# Altium schematic sheet ADC_1CH.SchDoc: Stabilizer
size 420 x 297 mm; EDA_Number: ARTIQ; Projet: Sampler; Author: G.Kasprowicz; CompanyName: WUT ISE; DrawnBy: G.Kasprowicz; Organization: WUT ISE; Address1: PW ISE; Address2: Nowowiejska 15/19 00-665 Warsaw; Address3: gkasprow@gmail.com; DocumentNumber: 8; Revision: 3.4; SheetNumber: 8; SheetTotal: 11; ModifiedBy: -; CheckedDate: -; Title2: ADC; DivGrp: WUT ISE; Designer: G.Kasprowicz; ModifiedDate: -; ProjectName: Sensor Box
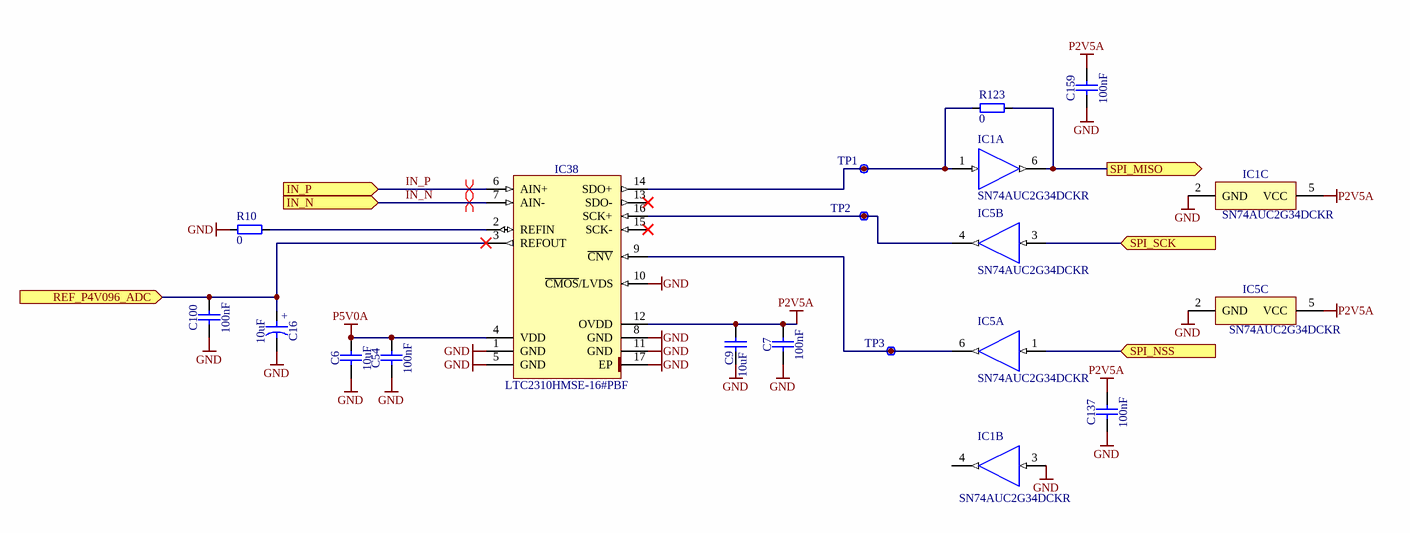
[diagram p0: ADC_1CH.SchDoc]

## Parts
C6  10uF  [CAPC2012X95N]
C7  100nF  [CAPC1005X55N]
C9  10uF  [CAPC2012X95N]
C16  10uF  [CAPMP3216X180N]
C54  100nF  [CAPC1005X55N]
C100  100nF  [CAPC1005X55N]
C137  100nF  [CAPC1005X55N]
C159  100nF  [CAPC1005X55N]
IC1  SN74AUC2G34DCKR  [DCK0006A_M]  (parts A,B,C of 3)
IC5  SN74AUC2G34DCKR  [DCK0006A_M]  (parts A,B,C of 3)
IC38  LTC2310HMSE-16#PBF  [SOP50P490X110-17N-R175X290]
R10  0  [RESC1005X40N]
R123  0  [RESC1005X40N]
TP1  Test Point  [TPS127]  (value not drawn)
TP2  Test Point  [TPS127]  (value not drawn)
TP3  Test Point  [TPS127]  (value not drawn)

## Ports
IN_N (in), IN_P (in), REF_P4V096_ADC (in), SPI_MISO (out), SPI_NSS (in), SPI_SCK (in)

## Nets
GND: C6.1 C7.1 C9.1 C16.2 C54.1 C100.1 C137.1 C159.1 IC1.2(GND) IC1.3(2A) IC5.2(GND) IC38.1(GND) IC38.5(GND) IC38.8(GND) IC38.10(~{CMOS}/LVDS) IC38.11(GND) IC38.17(EP) R10.1
P2V5A: C7.2 C9.2 C137.2 C159.2 IC1.5(VCC) IC5.5(VCC) IC38.12(OVDD)
P5V0A: C6.2 C54.2 IC38.4(VDD)
IN_N: IC38.7(AIN-) ; port IN_N
IN_P: IC38.6(AIN+) ; port IN_P
REF_P4V096_ADC: C16.1 C100.2 IC38.3(REFOUT) ; port REF_P4V096_ADC
SPI_MISO: IC1.6(1Y) R123.2 ; port SPI_MISO
SPI_NSS: IC5.1(1A) ; port SPI_NSS
SPI_SCK: IC5.3(2A) ; port SPI_SCK
NetIC1_1: IC1.1(1A) IC38.14(SDO+) R123.1 TP1.1
NetIC5_4: IC5.4(2Y) IC38.16(SCK+) TP2.1
NetIC5_6: IC5.6(1Y) IC38.9(~{CNV}) TP3.1
NetIC38_2: IC38.2(REFIN) R10.2

Not connected (* = marked no-connect by the designer): IC1 4(2Y); IC38 13(SDO-)* 15(SCK-)*

## Layout directives
differential pair: IN_N, IN_P

## Notes on the sheet
- Project/Equipment
- Document
- Designer
- Drawn by
- Check.by
- Copyright WUT ISE 2018.
  This documentation describes Open Hardware and is licensed under the CERN OHL v.1.1. You may redistribute and modify this documentation under the terms of the CERN OHL v.1.1. (http://ohwr.org/CERNOHL). This documentation is distributed WITHOUT ANY EXPRESS OR IMPLIED WARRANTY, INCLUDING OF MERCHANTABILITY, SATISFACTORY QUALITY AND FITNESS FOR A PARTICULAR PURPOSE. Please see the CERN OHL v.1.1 for applicable conditions.
- Contact
- File
- Last Mod.
- Print Date
- Sheet
- Size
- A3
- of
- Rev
- (in symbol CTE3216-18_10UF_16V_20%_AVX_TCJ) +

## Library data of the parts
C6 C9 = CC0805_10UF_25V_10%_X5R: Non-polarised capacitor; Part Description: SMD Multilayer Chip Ceramic Capacitor; Manufacturer: GENERIC; Manufacturer1 Part Number: GRM219R61E106KA12D; Voltage: 25V; TC: X5R; Tolerance: ±10%; Part Number: CC0805_10UF_25V_10%_X5R; Component Kind: Standard; Component Type: Standard; Pin Count: 2; Value: 10uF; Status: Preferred; Manufacturer Part Number: CC0805_10UF_25V_10%_X5R; Case: 0805; Mounted: Yes; Socket: No; SMD: Yes; Sense: No; Manufacturer1 Example: MURATA; Manufacturer1 ComponentHeight: 0.95mm; HelpURL: \\cern.ch\dfs\Applications\Altium\Datasheets\CC0805_X5R_MURATA_GRM.pdf; Author: CERN DEM JLC; CreateDate: 25.10.2012; LatestRevisionDate: 06.09.2016
C7 C54 C100 C137 C159 = CC0402_100NF_16V_10%_X7R: Non-polarised capacitor; Part Description: SMD Multilayer Chip Ceramic Capacitor; Manufacturer: GENERIC; Manufacturer1 Part Number: GRM155R71C104KA88D; Voltage: 16V; TC: X7R; Tolerance: ±10%; Part Number: CC0402_100NF_16V_10%_X7R; Component Kind: Standard; Component Type: Standard; Pin Count: 2; Value: 100nF; Status: Not Recommended; Manufacturer Part Number: CC0402_100NF_16V_10%_X7R; Case: 0402; Mounted: Yes; Socket: No; SMD: Yes; Sense: No; Manufacturer1 Example: MURATA; Manufacturer1 ComponentHeight: 0.55mm; HelpURL: \\cern.ch\dfs\Applications\Altium\Datasheets\CC0402_X7R_MURATA_GRM.pdf; Author: CERN DEM JLC; CreateDate: 05.12.2013; LatestRevisionDate: 03.12.2007
C16 = CTE3216-18_10UF_16V_20%_AVX_TCJ: Polarised capacitor; Part Description: ESR 0R200 Tantalum Solid Electrolytic Chip Capacitor with Conductive Polymer Electrode; Manufacturer: AVX; Manufacturer Part Number: TCJA106M016R0200; Voltage: 16V; Tolerance: ±20%; Part Number: CTE3216-18_10UF_16V_20%_AVX_TCJ; Component Kind: Standard; Component Type: Standard; Pin Count: 2; Value: 10uF; Status: Preferred; Case: A; Mounted: Yes; Socket: No; SMD: Yes; Sense: No; HelpURL: \\cern.ch\dfs\Applications\Altium\Datasheets\CTE_AVX_TCJ.pdf; Author: CERN DEM JLC; CreateDate: 29.03.2012; LatestRevisionDate: 29.03.2012; ComponentHeight: 1.8mm
IC1 IC5 = CMP-0859-00487-1: Dual Buffer Gate, DCK0006A, LARGE T&R; ICC @ Nom Voltage(Max)(mA): 0.01; 3-State Output: No; Input Type: CMOS; VCC(Min)(V): 0.8; VCC(Max)(V): 2.7; Technology Family: AUC; Logic: True; Output Drive (IOL/IOH)(Max)(mA): 9/-9; Rating: Catalog; Sub-Family: Non-Inverting Buffer/Driver; Bits(#): 2; F @ Nom Voltage(Max)(Mhz): 250; tpd @ Nom Voltage(Max)(ns): 6.4,3.4,2.3,1.6,1.2; Voltage(Nom)(V): 0.8,1.2,1.5,1.8,2.5; ComponentLink1URL: http://www.ti.com/; PackageReference: DCK0006A; PartNumber: SN74AUC2G34DCKR; ComponentLink1Description: Manufacturer URL; ComponentLink2URL: http://www.ti.com/lit/ds/symlink/sn74auc2g34.pdf; Part Number: SN74AUC2G34; Operating Temperature Range(C): -40 to 85; Output Type: CMOS; DatasheetVersion: SCES514B; ComponentLink2Description: Datasheet; Schmitt Trigger: No
IC38 = LTC2310HMSE-16#PBF: 16-Bit, 2Msps Differential Input ADC with Wide Input Common Mode Range; Manufacturer: LINEAR TECHNOLOGY; PressFit: No; Bonding: No; Part Number: LTC2310HMSE-16#PBF; Component Kind: Standard; Component Type: Standard; Device: LTC2310HMSE-16#PBF; PackageDescription: MSOP16, Pitch 0.5mm - Body 3x4mm, (w/thermal tab 1.75mm X 2.9mm), IPC Medium Density; Part Description: 16-Bit, 2Msps Differential Input ADC with Wide Input Common Mode Range; Manufacturer Part Number: LTC2310HMSE-16#PBF; Pin Count: 17; Case: MSOP16; Mounted: YES; Socket: No; SMD: Yes; Sense: No; ComponentHeight: 1.1mm; Author: CERN DEM JLC; HelpURL: \\cern.ch\dfs\Applications\Altium\Datasheets\LTC2310HMSE-16#PBF.pdf; CreateDate: 29.11.2018; LatestRevisionDate: 29.11.2018
R10 R123 = R0402_0R_JUMPER: Resistor; Part Description: 1A (0.05R Max DC Resistance) Zero Ohm Jumper; Manufacturer: GENERIC; Manufacturer1 Part Number: 232270591001L; Part Number: R0402_0R_JUMPER; Component Kind: Standard; Component Type: Standard; Pin Count: 2; Value: 0; Status: Not recommended; Manufacturer Part Number: R0402_0R_JUMPER; Case: 0402; Mounted: Yes; Sense: No; Socket: No; SMD: Yes; Manufacturer1 Example: YAGEO PHYCOMP; Manufacturer1 ComponentHeight: 0.4mm; HelpURL: \\cern.ch\dfs\Applications\Altium\Datasheets\R0402_Phycomp_RC0402.pdf; Author: CERN DEM JLC; CreateDate: 03.12.2007; LatestRevisionDate: 17.10.2012
TP1-TP3 = SMD_PAD_1.27X1.27MM: Part Description: 1.27mm x 1.27mm PCB Copper Area (SMD Test Point); Mounted: No; Part Number: SMD_PAD_1.27X1.27MM; Component Kind: Standard (No BOM); Component Type: Standard (No BOM); Pin Count: 1; Family: Test Point; Socket: No; SMD: Yes; Sense: No; Status: None; ComponentHeight: 0mm; HelpURL: Undefined; Author: CERN DEM JLC; CreateDate: 12.01.2008; LatestRevisionDate: 12.01.2008; PackageDescription: 1.27mm x 1.27mm PCB Copper Area (SMD Test Point)